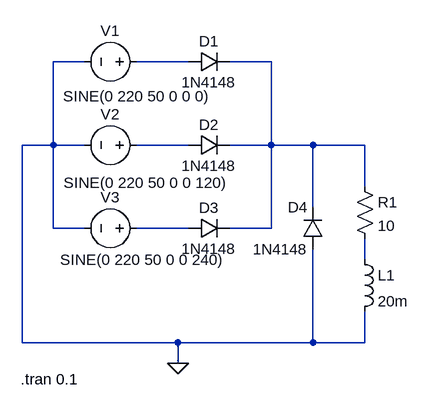
[diagram p0: schematic 3 Phase HWR-RL-FD.asc]
3 Phase HWR-RL-FD.asc, the LTspice schematic file:
Version 4
SHEET 1 880 680
WIRE 32 80 -16 80
WIRE 192 80 112 80
WIRE 320 80 256 80
WIRE -16 208 -16 80
WIRE -16 208 -64 208
WIRE 32 208 -16 208
WIRE 192 208 112 208
WIRE 320 208 320 80
WIRE 320 208 256 208
WIRE 384 208 320 208
WIRE 464 208 384 208
WIRE 464 272 464 208
WIRE 384 304 384 208
WIRE -16 336 -16 208
WIRE 32 336 -16 336
WIRE 192 336 112 336
WIRE 320 336 320 208
WIRE 320 336 256 336
WIRE 464 384 464 352
WIRE -64 512 -64 208
WIRE 176 512 -64 512
WIRE 384 512 384 368
WIRE 384 512 176 512
WIRE 464 512 464 464
WIRE 464 512 384 512
WIRE 176 544 176 512
FLAG 176 544 0
SYMBOL voltage 128 80 R90
WINDOW 0 -32 56 VBottom 2
WINDOW 3 37 15 VTop 2
WINDOW 123 0 0 Left 0
WINDOW 39 0 0 Left 0
SYMATTR InstName V1
SYMATTR Value SINE(0 220 50 0 0 0)
SYMBOL voltage 128 208 R90
WINDOW 0 -32 56 VBottom 2
WINDOW 3 42 1 VTop 2
WINDOW 123 0 0 Left 0
WINDOW 39 0 0 Left 0
SYMATTR InstName V2
SYMATTR Value SINE(0 220 50 0 0 120)
SYMBOL voltage 128 336 R90
WINDOW 0 -32 56 VBottom 2
WINDOW 3 33 6 VTop 2
WINDOW 123 0 0 Left 0
WINDOW 39 0 0 Left 0
SYMATTR InstName V3
SYMATTR Value SINE(0 220 50 0 0 240)
SYMBOL diode 192 96 R270
WINDOW 0 32 32 VTop 2
WINDOW 3 0 32 VBottom 2
SYMATTR InstName D1
SYMATTR Value 1N4148
SYMBOL diode 192 224 R270
WINDOW 0 32 32 VTop 2
WINDOW 3 0 32 VBottom 2
SYMATTR InstName D2
SYMATTR Value 1N4148
SYMBOL diode 192 352 R270
WINDOW 0 32 32 VTop 2
WINDOW 3 0 32 VBottom 2
SYMATTR InstName D3
SYMATTR Value 1N4148
SYMBOL res 448 256 R0
SYMATTR InstName R1
SYMATTR Value 10
SYMBOL ind 448 368 R0
SYMATTR InstName L1
SYMATTR Value 20m
SYMBOL diode 400 368 R180
WINDOW 0 24 64 Left 2
WINDOW 3 24 0 Left 2
SYMATTR InstName D4
SYMATTR Value 1N4148
TEXT -66 568 Left 2 !.tran 0.1

The netlist it stands for:
* 3 Phase HWR-RL-FD.asc
V1 N001 0 SINE(0 220 50 0 0 0)
V2 N003 0 SINE(0 220 50 0 0 120)
V3 N004 0 SINE(0 220 50 0 0 240)
D1 N001 N002 1N4148
D2 N003 N002 1N4148
D3 N004 N002 1N4148
R1 N002 N005 10
L1 N005 0 20m
D4 0 N002 1N4148
.model D D
.lib standard.dio
.tran 0.1
.backanno
.end